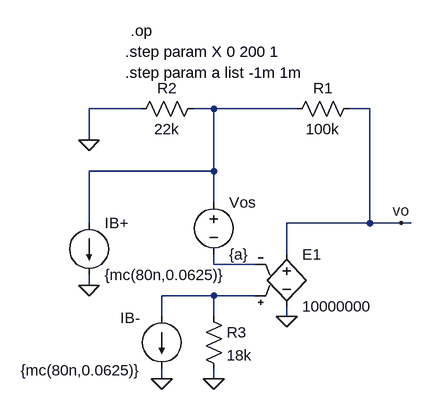
[diagram p0: schematic mcoffset1.asc]
mcoffset1.asc, the LTspice schematic file:
Version 4
SHEET 1 1516 692
WIRE 96 -768 16 -768
WIRE 208 -768 176 -768
WIRE 336 -768 208 -768
WIRE 448 -768 416 -768
WIRE 16 -720 16 -768
WIRE 208 -672 208 -768
WIRE 208 -672 16 -672
WIRE 208 -624 208 -672
WIRE 16 -592 16 -672
WIRE 448 -592 448 -768
WIRE 448 -592 320 -592
WIRE 496 -592 448 -592
WIRE 512 -592 496 -592
WIRE 320 -544 320 -592
WIRE 208 -528 208 -544
WIRE 272 -528 208 -528
WIRE 16 -496 16 -512
WIRE 208 -480 128 -480
WIRE 272 -480 208 -480
WIRE 128 -448 128 -480
WIRE 208 -448 208 -480
WIRE 320 -448 320 -464
WIRE 128 -352 128 -368
WIRE 208 -352 208 -368
FLAG 320 -448 0
FLAG 208 -352 0
FLAG 16 -496 0
FLAG 128 -352 0
FLAG 496 -592 vo
FLAG 16 -720 0
SYMBOL e2 320 -560 R0
SYMATTR InstName E1
SYMATTR Value 10000000
SYMBOL res 432 -784 R90
WINDOW 0 0 56 VBottom 2
WINDOW 3 32 56 VTop 2
SYMATTR InstName R1
SYMATTR Value 100k
SYMBOL res 192 -784 R90
WINDOW 0 0 56 VBottom 2
WINDOW 3 32 56 VTop 2
SYMATTR InstName R2
SYMATTR Value 22k
SYMBOL res 192 -464 R0
SYMATTR InstName R3
SYMATTR Value 18k
SYMBOL voltage 208 -640 R0
WINDOW 123 0 0 Left 0
WINDOW 39 0 0 Left 0
SYMATTR InstName Vos
SYMATTR Value {a}
SYMBOL current 16 -592 R0
WINDOW 123 0 0 Left 0
WINDOW 39 0 0 Left 0
SYMATTR InstName IB+
SYMATTR Value {mc(80n,0.0625)}
SYMBOL current 128 -448 R0
WINDOW 123 0 0 Left 0
WINDOW 39 0 0 Left 0
WINDOW 0 -64 2 Left 2
WINDOW 3 -217 83 Left 2
SYMATTR InstName IB-
SYMATTR Value {mc(80n,0.0625)}
TEXT 72 -856 Left 2 !.step param X 0 200 1
TEXT 80 -888 Left 2 !.op
TEXT 72 -824 Left 2 !.step param a list -1m 1m

The netlist it stands for:
* mcoffset1.asc
E1 vo 0 N003 N002 10000000
R1 vo N001 100k
R2 N001 0 22k
R3 N003 0 18k
Vos N001 N002 {a}
IB+ N001 0 {mc(80n,0.0625)}
IB- N003 0 {mc(80n,0.0625)}
.step param X 0 200 1
.op
.step param a list -1m 1m
.backanno
.end